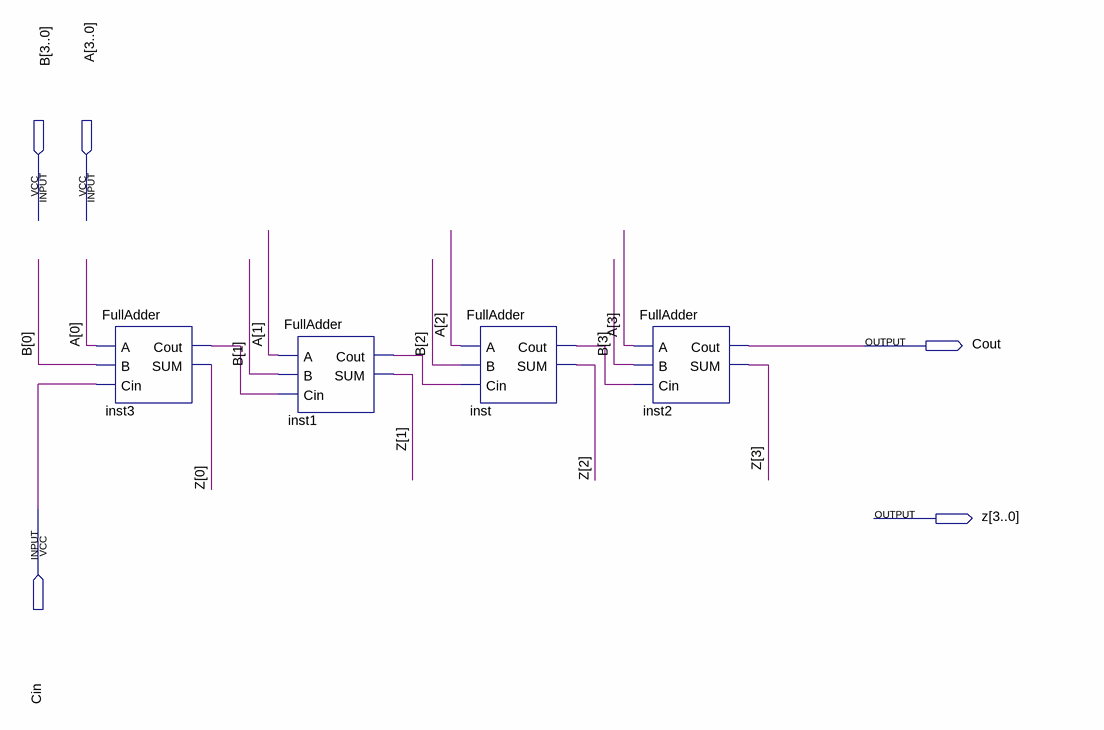
[diagram p0: schematic sheet]
// Quartus schematic FourBitAdder.bdf as structural Verilog: 4 symbols, 5 pins
module FourBitAdder (
  input  [3:0] B,
  input  [3:0] A,
  input  Cin,
  output Cout,
  output [3:0] z
);

  wire inst1_cout, inst3_cout, inst_cout;

  FullAdder inst3 (.A(A[0]), .B(B[0]), .Cin(Cin), .Cout(inst3_cout), .SUM(z[0]));
  FullAdder inst1 (.A(A[1]), .B(B[1]), .Cin(inst3_cout), .Cout(inst1_cout), .SUM(z[1]));
  FullAdder inst (.A(A[2]), .B(B[2]), .Cin(inst1_cout), .Cout(inst_cout), .SUM(z[2]));
  FullAdder inst2 (.A(A[3]), .B(B[3]), .Cin(inst_cout), .Cout(Cout), .SUM(z[3]));
endmodule
